# EAGLE design ottoesp-wrover (EAGLE 9.6.2)
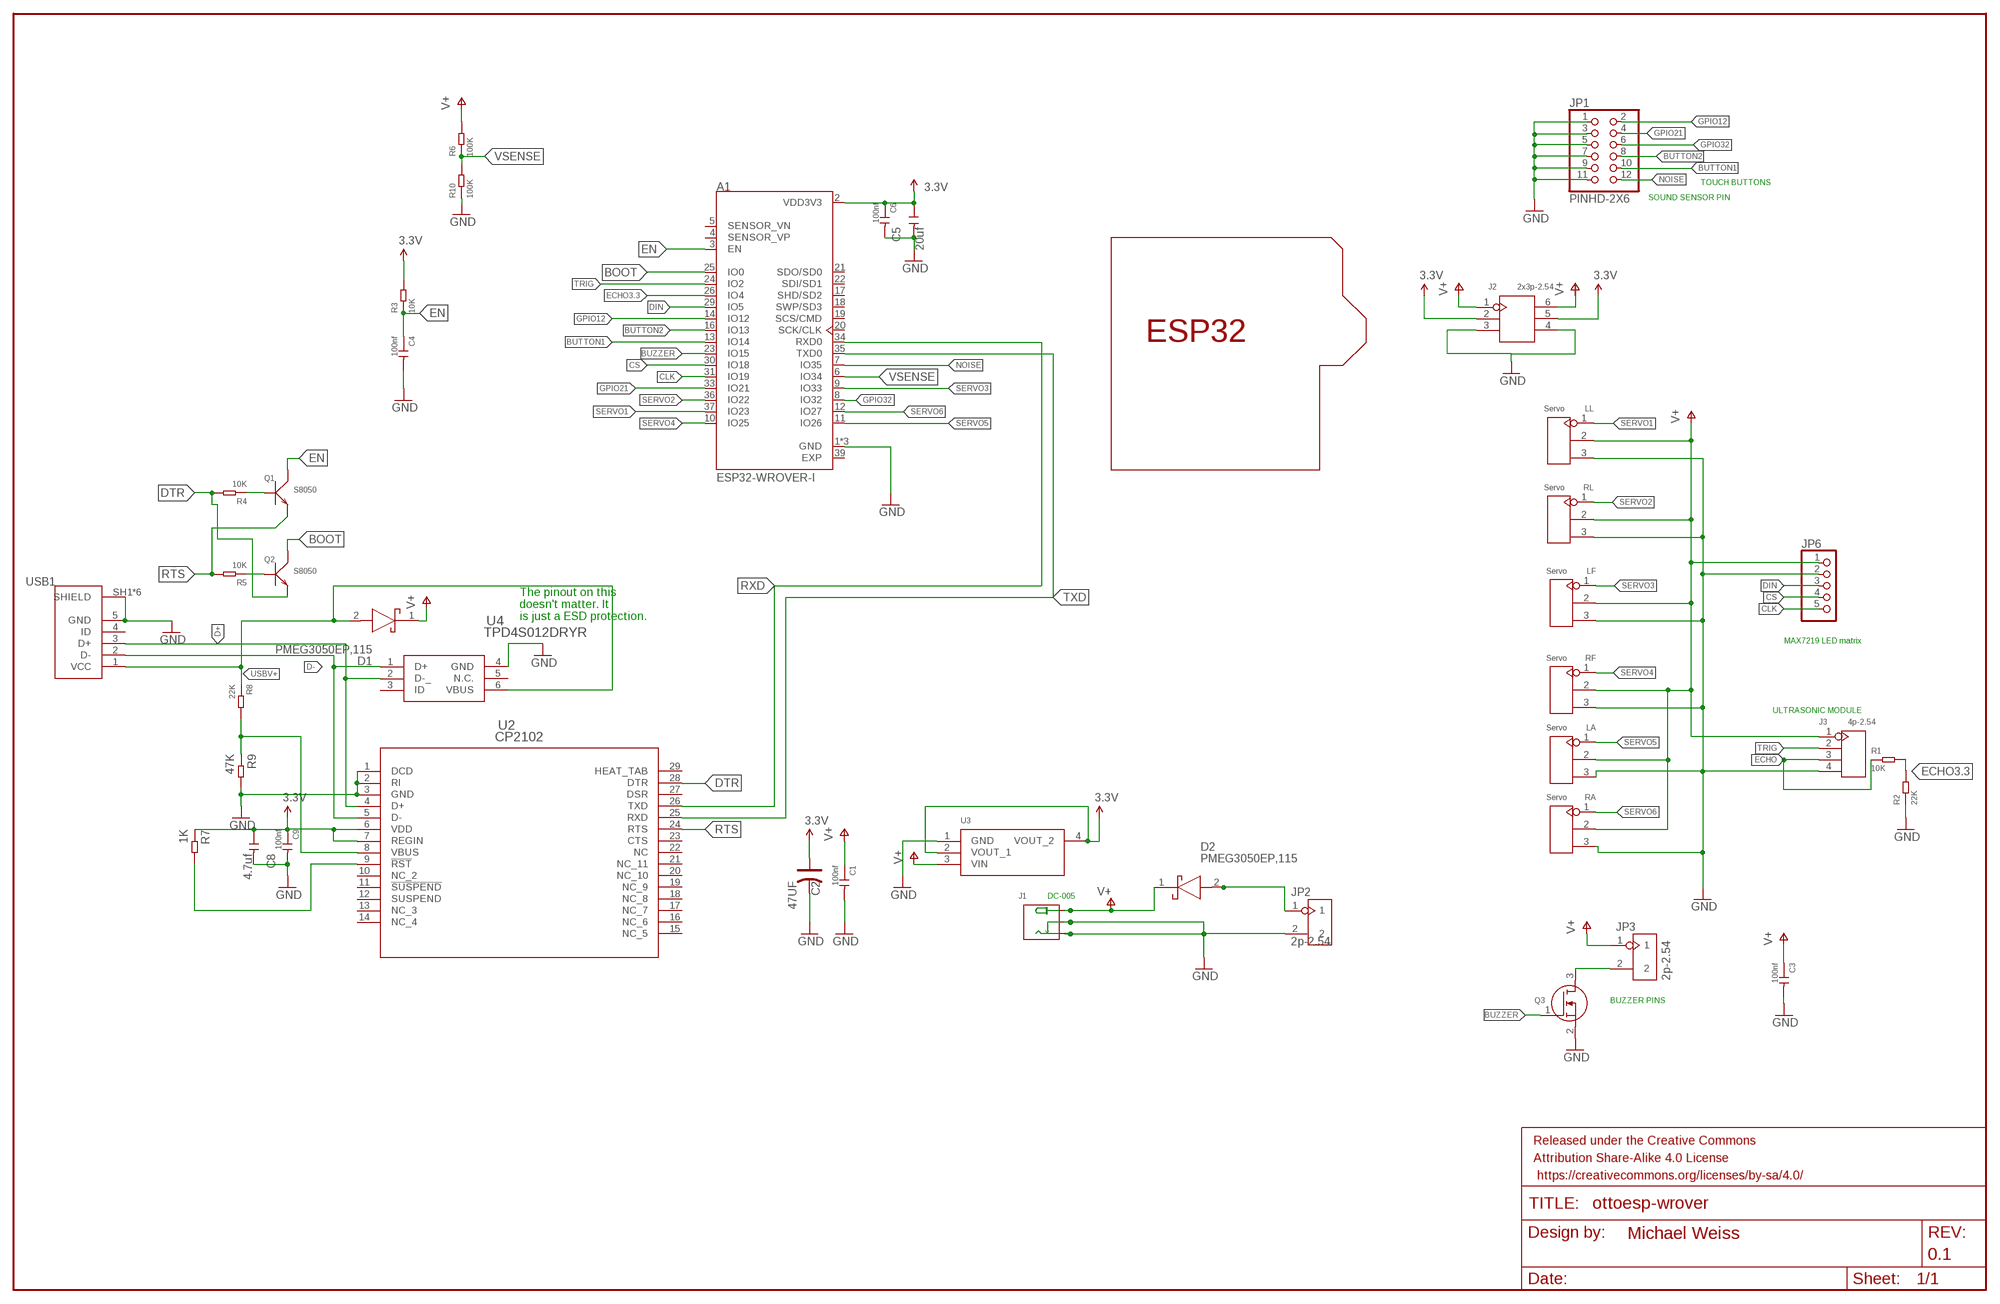
[diagram p0: schematic, sheet 1]

## Parts
A1  ESP32-WROVER-I  [XCVR_ESP32-WROVER-I]
C1  100nf  CERAMIC-100NF-50V-10%-X7R(0805)  [C0805]
C2  47UF  ALUMINUM-SMD-47UF-25V(D6.3-H5.3MM)  [ELECTRO-SMD-C-6MM]
C3  100nf  CERAMIC-100NF-50V-10%-X7R(0805)  [C0805]
C4  100nf  CERAMIC-100NF-50V-10%-X7R(0805)  [C0805]
C5  20uf  CERAMIC-22UF-16V-10%-X7R(1206)  [C1206]
C6  100nf  CERAMIC-100NF-50V-10%-X7R(0805)  [C0805]
C8  4.7uf  CERAMIC-4.7UF-25V-10%-X5R(0805)  [C0805]
C9  100nf  CERAMIC-100NF-50V-10%-X7R(0805)  [C0805]
D1  PMEG3050EP,115  [PMEG3050EP115]
D2  PMEG3050EP,115  [PMEG3050EP115]
FRAME1  FRAME-LEDGERMISHAFARMS  [MISHAFARMS]
J1  DC-005  CONN-POWER-JACK-2.1MM(DC-005)  [DCJ3P-14.2X11.0X9.0MM]
J2  2x3p-2.54  DIP-BLACK-MALE-HEADER(2X3P-2.54）-2.54  [H2X3-2.54]
J3  4p-2.54  DIP-BLACK-MALE-HEADER-VERT(4P-2.54)  [H4-2.54]
JP1  PINHD-2X6  [2X06]
JP2  2p-2.54  DIP-BLACK-MALE-HEADER-VERT(2P-2.54)  [H2-2.54]
JP3  2p-2.54  DIP-BLACK-MALE-HEADER-VERT(2P-2.54)  [H2-2.54]
JP6  PINHD-1X5  [1X05]
LA  Servo  DIP-BLACK-MALE-HEADER-VERT(3P-2.54)  [H3-2.54]
LF  Servo  DIP-BLACK-MALE-HEADER-VERT(3P-2.54)  [H3-2.54]
LL  Servo  DIP-BLACK-MALE-HEADER-VERT(3P-2.54)  [H3-2.54]
Q1  S8050  SMD-TRANSISTORS-NPN-25V-500MW-S8050(SOT-23)  [SOT-23]
Q2  S8050  SMD-TRANSISTORS-NPN-25V-500MW-S8050(SOT-23)  [SOT-23]
Q3  CJ2302  2N7002NXAKR  [SOT95P230X110-3N]
R1  10K  SMD-RES-10K-1%-1/8W(0805)  [R0805]
R2  22K  SMD-RES-20K-5%-1/8W(0805)  [R0805]
R3  10K  SMD-RES-10K-1%-1/8W(0805)  [R0805]
R4  10K  SMD-RES-10K-1%-1/8W(0805)  [R0805]
R5  10K  SMD-RES-10K-1%-1/8W(0805)  [R0805]
R6  100K  SMD-RES-100K-1%-1/8W(0805)  [R0805]
R7  1K  SMD-RES-2K-1%-1/8W(0805)  [R0805]
R8  22K  SMD-RES-22K-1%-1/8W(0805)  [R0805]
R9  47K  SMD-RES-47R-1%-1/8W(0805)  [R0805]
R10  100K  SMD-RES-100K-1%-1/8W(0805)  [R0805]
RA  Servo  DIP-BLACK-MALE-HEADER-VERT(3P-2.54)  [H3-2.54]
RF  Servo  DIP-BLACK-MALE-HEADER-VERT(3P-2.54)  [H3-2.54]
RL  Servo  DIP-BLACK-MALE-HEADER-VERT(3P-2.54)  [H3-2.54]
U2  CP2102  [QFN28N5X5-0P5P]
U3  CJA1117B-3.3-SOT89  AP2114H-3.3TRG1  [SOT230P700X180-4N]
U4  TPD4S012DRYR  [TPD4S012DRYR]
U$2  ESP32_SHIELDSMALL  [ESP32_ARDUINOSHIELDSMALL]
USB1  ZX62-B-5PA  ZX62-B-5PA(33)  [HRS_ZX62-B-5PA(33)]

## Nets
3.3V [3.3V]: A1.2(VDD3V3) C2.+ C5.1 C6.1 C8.1 C9.1 J2.2 J2.5 R3.2 R7.1 U2.6(VDD) U2.7(REGIN) U3.2(VOUT_1) U3.4(VOUT_2)
BOOT: A1.25(IO0) Q2.3(C)
BUTTON1: A1.13(IO14) JP1.10
BUTTON2: A1.16(IO13) JP1.8
BUZZER: A1.23(IO15) Q3.1(G)
CLK: A1.31(IO19) JP6.5
CS: A1.30(IO18) JP6.4
D+: U2.4(D+) U4.2(D-_) USB1.3(D+)
D-: U2.5(D-) U4.1(D+) USB1.2(D-)
DIN: A1.29(IO5) JP6.3
DTR: Q2.2(E) R4.2 U2.28(DTR)
ECHO: J3.3 R1.1
ECHO3.3: A1.26(IO4) R1.2 R2.2
EN: A1.3(EN) C4.1 Q1.3(C) R3.1
GND: A1.1(GND) A1.15(GND) A1.38(GND) C1.2 C2.- C3.2 C4.2 C5.2 C6.2 C8.2 C9.2 J1.-1(-) J1.-2(CDN) J2.3 J2.4 J3.4 JP1.1 JP1.3 JP1.5 JP1.7 JP1.9 JP1.11 JP2.2 JP6.2 LA.3 LF.3 LL.3 Q3.2(S) R2.1 R9.2 R10.1 RA.3 RF.3 RL.3 U2.1(DCD) U2.2(RI) U2.3(GND) U3.1(GND) U4.4(GND) USB1.5(GND) USB1.SH1(SHIELD) USB1.SH2(SHIELD) USB1.SH3(SHIELD) USB1.SH4(SHIELD) USB1.SH5(SHIELD) USB1.SH6(SHIELD)
GPIO12: A1.14(IO12) JP1.2
GPIO21: A1.33(IO21) JP1.4
GPIO32: A1.8(IO32) JP1.6
N$3: JP3.2 Q3.3(D)
N$4: Q1.1(B) R4.1
N$5: Q2.1(B) R5.1
N$6: R7.2 U2.9(!RST)
N$7: R8.2 R9.1 U2.8(VBUS)
N$11 [V+]: D2.2(A) JP2.1
NOISE: A1.7(IO35) JP1.12
RTS: Q1.2(E) R5.2 U2.24(RTS)
RXD: A1.34(RXD0) U2.26(TXD)
SERVO1: A1.37(IO23) LL.1
SERVO2: A1.36(IO22) RL.1
SERVO3: A1.9(IO33) LF.1
SERVO4: A1.10(IO25) RF.1
SERVO5: A1.11(IO26) LA.1
SERVO6: A1.12(IO27) RA.1
TRIG: A1.24(IO2) J3.2
TXD: A1.35(TXD0) U2.25(RXD)
USBV+: D1.2(A) R8.1 U4.6(VBUS) USB1.1(VCC)
V+ [V+]: C1.1 C3.1 D1.1(K) D2.1(K) J1.+ J2.1 J2.6 J3.1 JP3.1 JP6.1 LA.2 LF.2 LL.2 R6.2 RA.2 RF.2 RL.2 U3.3(VIN)
VSENSE: A1.6(IO34) R6.1 R10.2
Unconnected: A1.4(SENSOR_VP) A1.5(SENSOR_VN) A1.17(SHD/SD2) A1.18(SWP/SD3) A1.19(SCS/CMD) A1.20(SCK/CLK) A1.21(SDO/SD0) A1.22(SDI/SD1) U2.10(NC_2) U2.11(!SUSPEND) U2.12(SUSPEND) U2.13(NC_3) U2.14(NC_4) U2.15(NC_5) U2.16(NC_6) U2.17(NC_7) U2.18(NC_8) U2.19(NC_9) U2.20(NC_10) U2.21(NC_11) U2.22(NC) U2.23(CTS) U2.27(DSR) U2.29(HEAT_TAB) U4.3(ID) U4.5(N.C.) USB1.4(ID)

## Notes on the sheet
- TOUCH BUTTONS
- SOUND SENSOR PIN
- The pinout on this
  doesn't matter. It
  is just a ESD protection.
- MAX7219 LED matrix
- ULTRASONIC MODULE
- BUZZER PINS

## Power pins joined to a net without a drawn wire
EXP: A1.39(EXP)

## Library data of the parts
A1 = ESP32-WROVER-I:ESP32-WROVER-I: Module: combo; GPIO, I2C x2, I2S x2, SDIO, SPI x3, UART x3; U.FL; AVAILABILITY: Unavailable; DESCRIPTION: Module: combo; GPIO, I2C x2, I2S x2, SDIO, SPI x3, UART x3; U.FL; MF: Espressif Systems; MP: ESP32-WROVER-I; PACKAGE: Module Espressif Systems; PRICE: None
C1 C4 C6 C9 = OPL_Capacitor:CERAMIC-100NF-50V-10%-X7R(0805): 302010165; MPN: CC0805KRX7R9BB104
C2 = OPL_Capacitor:ALUMINUM-SMD-47UF-25V(D6.3-H5.3MM): 302030059; MPN: CS1E470M-CRE54
C3 = Seeed-Capacitor:CERAMIC-100NF-50V-10%-X7R(0805): 302010165; MPN: CC0805KRX7R9BB104
C5 = OPL_Capacitor:CERAMIC-22UF-16V-10%-X7R(1206): 302010182
C8 = OPL_Capacitor:CERAMIC-4.7UF-25V-10%-X5R(0805): 302010146; MPN: CC0805KKX5R8BB475
D1 D2 = SamacSys_Parts:PMEG3050EP,115: NXP PMEG3050EP,115 SMT Schottky Diode, 30V 5A, 2-Pin SOD-128 Source: Datasheet; DESCRIPTION: NXP PMEG3050EP,115 SMT Schottky Diode, 30V 5A, 2-Pin SOD-128; HEIGHT: 1mm; MANUFACTURER_NAME: Nexperia; MANUFACTURER_PART_NUMBER: PMEG3050EP,115; MOUSER_PART_NUMBER: 771-PMEG3050EP115; MOUSER_PRICE-STOCK: https://www.mouser.co.uk/ProductDetail/Nexperia/PMEG3050EP115?qs=GcY6OjH1zdmnjQ%2FhUT5aOA%3D%3D
FRAME1 = SparkFun-Aesthetics:FRAME-LEDGER: Schematic Frame - Ledger Standard 11x14 US Ledger frame; DESIGNER: Michael Weiss; REV: 0.1
J1 = OPL_Connector:CONN-POWER-JACK-2.1MM(DC-005): 320120003; MPN: DC-005
J2 = OPL_Connector:DIP-BLACK-MALE-HEADER(2X3P-2.54）: 320020077; MPN: P125-12A1BS116A1
J3 = OPL_Connector:DIP-BLACK-MALE-HEADER-VERT(4P-2.54): 320020017; MPN: P125-1104A0BS116A1
JP1 = Connector:PINHD-2X6: PIN HEADER; CATEGORY: CONNECTOR; SUB-CATEGORY: PIN-HEADER
JP2 JP3 = OPL_Connector:DIP-BLACK-MALE-HEADER-VERT(2P-2.54): 320020016; MPN: P125-1102A0BS116A1
JP6 = pinhead:PINHD-1X5: PIN HEADER
LA LF LL RA RF RL = OPL_Connector:DIP-BLACK-MALE-HEADER-VERT(3P-2.54): 320020079; VALUE: 3p-2.54
Q1 Q2 = OPL_Discrete_Semiconductor:SMD-TRANSISTORS-NPN-25V-500MW-S8050(SOT-23): 305010017; MPN: S8050
Q3 = SamacSys_Parts:2N7002NXAKR: NEXPERIA - 2N7002NXAKR - MOSFET Transistor, Trench, N Channel, 190 mA, 60 V, 3 ohm, 10 V, 1.6 V Source: Datasheet; DESCRIPTION: NEXPERIA - 2N7002NXAKR - MOSFET Transistor, Trench, N Channel, 190 mA, 60 V, 3 ohm, 10 V, 1.6 V; HEIGHT: 1.1mm; MANUFACTURER_NAME: Nexperia; MANUFACTURER_PART_NUMBER: 2N7002NXAKR; MOUSER_PART_NUMBER: 771-2N7002NXAKR; MOUSER_PRICE-STOCK: https://www.mouser.co.uk/ProductDetail/Nexperia/2N7002NXAKR?qs=%252B6g0mu59x7JoAsZYPFXqhw%3D%3D
R1 R3-R5 = OPL_Resistor:SMD-RES-10K-1%-1/8W(0805): 301012152; MPN: RC0805FR-0710KL
R2 = OPL_Resistor:SMD-RES-20K-5%-1/8W(0805): 301012190; MPN: RC0805JR-071KL; VALUE: 1K
R6 R10 = OPL_Resistor:SMD-RES-100K-1%-1/8W(0805): 301012150; MPN: RC0805JR-071KL; VALUE: 1K
R7 = OPL_Resistor:SMD-RES-2K-1%-1/8W(0805): 301012164; MPN: RC0805JR-071KL
R8 = OPL_Resistor:SMD-RES-22K-1%-1/8W(0805): 301012161; MPN: RC0805JR-071KL; VALUE: 1K
R9 = OPL_Resistor:SMD-RES-47R-1%-1/8W(0805): 301012174; MPN: RC0805JR-071KL; VALUE: 1K
U2 = cp2102:CP2102; MANUFACTURER_PART_NUMBER: CP2102; VENDOR: Silicon Labs
U3 = SamacSys_Parts:AP2114H-3.3TRG1: 1A 3.3V Low Noise LDO Regulator SOT223 DiodesZetex AP2114H-3.3TRG1, LDO Voltage Regulator, 1 (Min)A, 3.3 V +/-1.5%, 2.5 6 Vin, 3-Pin SOT-223 Source: Datasheet; DESCRIPTION: 1A 3.3V Low Noise LDO Regulator SOT223 DiodesZetex AP2114H-3.3TRG1, LDO Voltage Regulator, 1 (Min)A, 3.3 V +/-1.5%, 2.5 6 Vin, 3-Pin SOT-223; HEIGHT: 1.8mm; MANUFACTURER_NAME: Diodes Inc.; MANUFACTURER_PART_NUMBER: AP2114H-3.3TRG1; MOUSER_PART_NUMBER: 621-AP2114H-3.3TRG1; MOUSER_PRICE-STOCK: https://www.mouser.co.uk/ProductDetail/Diodes-Incorporated/AP2114H-33TRG1?qs=x6A8l6qLYDDSG%2FfwzcsOhw%3D%3D
U4 = SamacSys_Parts:TPD4S012DRYR: ESD Suppressors / TVS Diodes 4Ch USB ESD Solution w/ Pwr Clamp Source: Datasheet <https://www.ti.com/lit/gpn/TPD4S012>; DESCRIPTION: ESD Suppressors / TVS Diodes 4Ch USB ESD Solution w/ Pwr Clamp; HEIGHT: 0.6mm; MANUFACTURER_NAME: Texas Instruments; MANUFACTURER_PART_NUMBER: TPD4S012DRYR; MOUSER_PART_NUMBER: 595-TPD4S012DRYR; MOUSER_PRICE-STOCK: https://www.mouser.co.uk/ProductDetail/Texas-Instruments/TPD4S012DRYR?qs=XGzIaZb%2FFYJve%2FbrCpoVgg%3D%3D
U$2 = ottoesp:ESP32_SHIELDSMALL
USB1 = XLibrary:ZX62-B-5PA(33): ZX Series 5 Position Right Angle PCB Wire Micro B USB Plug; AVAILABILITY: Unavailable; DESCRIPTION: ZX Series 5 Position Right Angle PCB Wire Micro B USB Plug; MF: Hirose; MP: ZX62-B-5PA_33_; PACKAGE: None; PRICE: None

## Net classes
1 3.3V: width 0.406 mm
2 V+: width 1.016 mm

## Board
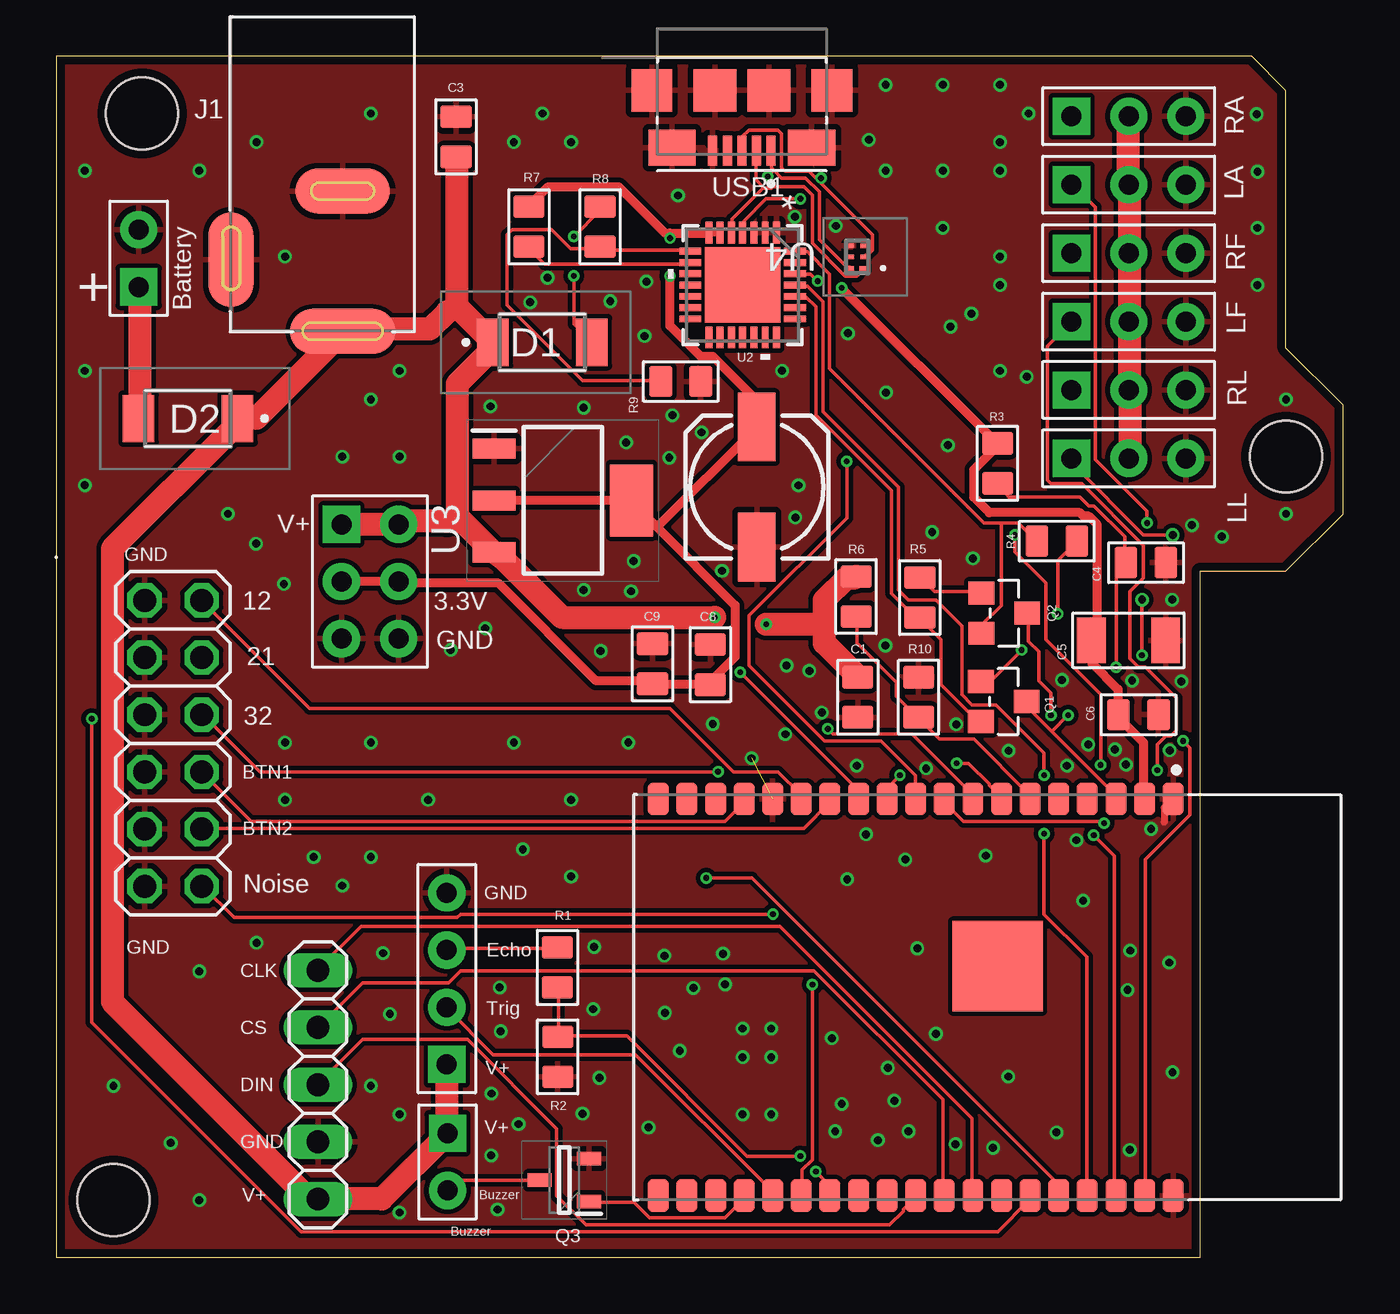
[diagram p1: board, top side]
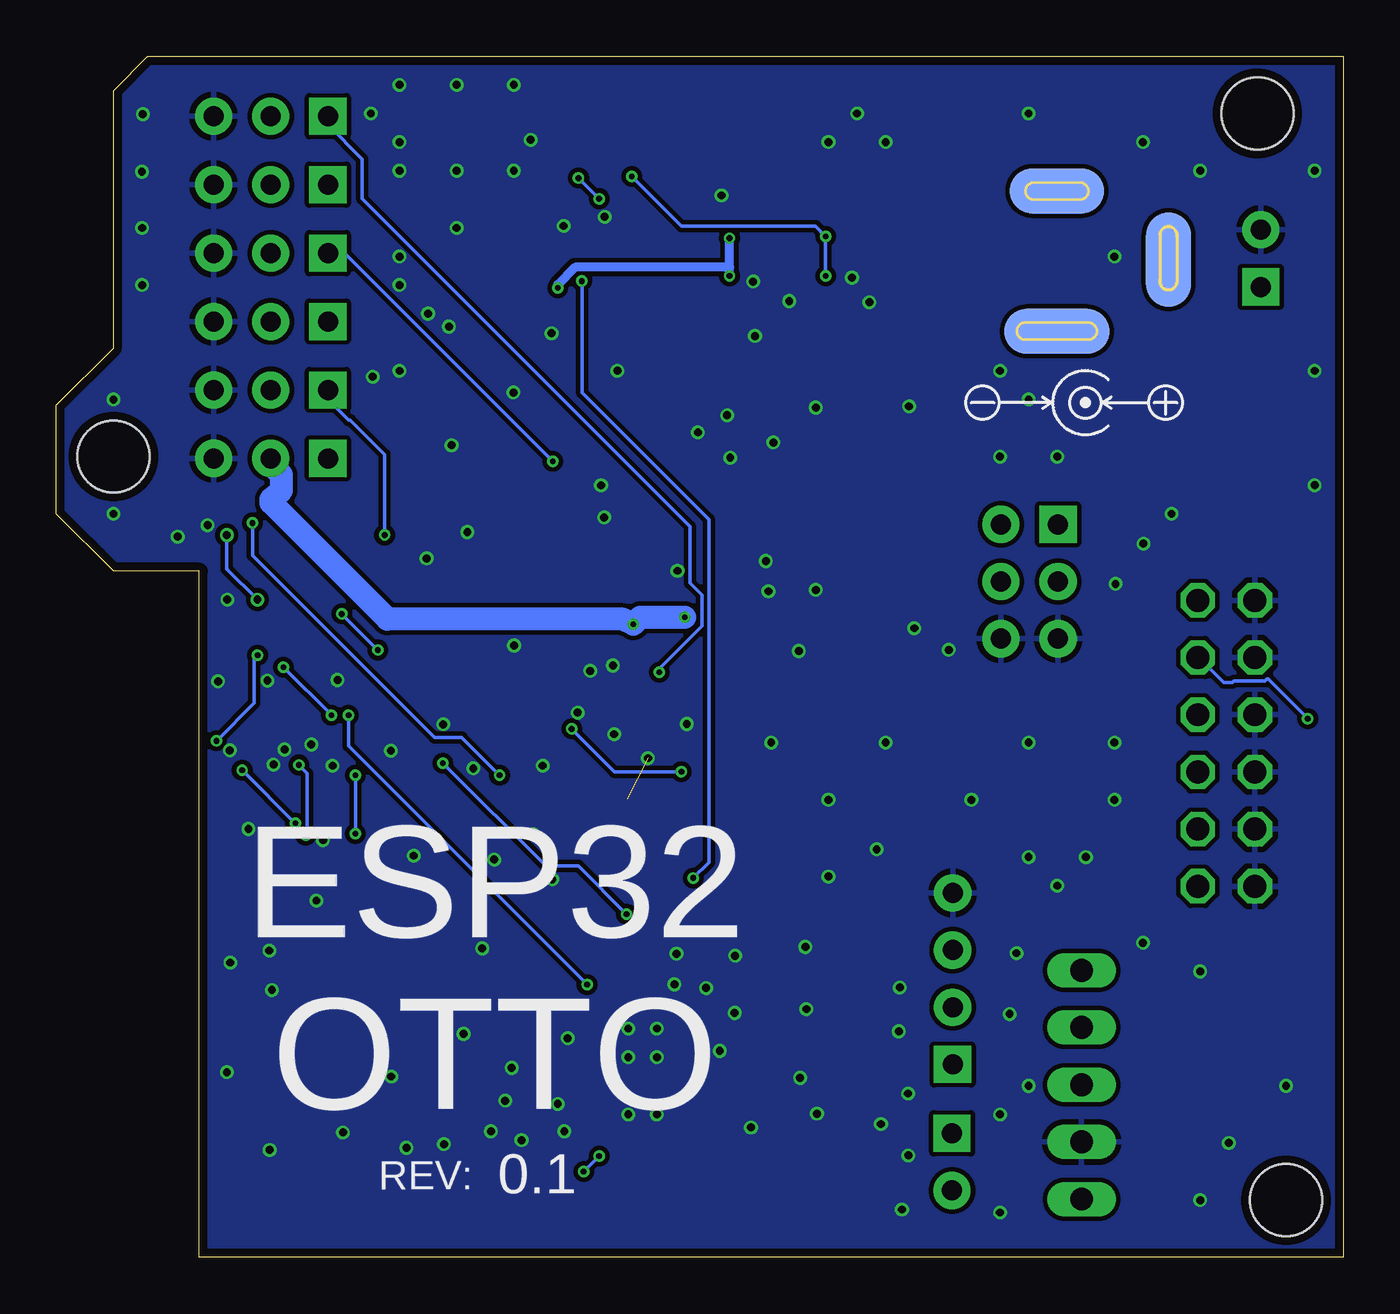
[diagram p2: board, bottom side, seen from below]

Size 57.15 x 53.34 mm. Coordinates in mm from the lower left corner, seen from the top.
Copper layers (1*16): Top 0.035559375mm / dielectric 1.6mm / Bottom 0.035559375mm
Design rules "oshpark-2layer": minimum track width 6mil, minimum drill 10mil, track to track 6mil, track to pad 6mil, pad to pad 6mil, via to via 6mil, smd to smd 6mil, copper to edge 15mil, drill to drill 6mil, minimum pad ring 5mil, minimum via ring 5mil, stop-mask expansion 2.5mil, vias tented up to drill 0mil, thermal gap 10mil

### Footprints (pad centres in the part's own frame; a part is rotated, then mirrored left to right if it is on the bottom)
XCVR_ESP32-WROVER-I = smd 1.45 x 0.93: 1 -8.81,8.26; 2 -8.81,6.99; 3 -8.81,5.72; 4 -8.81,4.45; 5 -8.81,3.18; 6 -8.81,1.91; 7 -8.81,0.64; 8 -8.81,-0.63; 9 -8.81,-1.9; 10 -8.81,-3.17; 11 -8.81,-4.44; 12 -8.81,-5.71; 13 -8.81,-6.98; 14 -8.81,-8.25; 15 -8.81,-9.52; 16 -8.81,-10.79; 17 -8.81,-12.06; 18 -8.81,-13.33; 19 -8.81,-14.6; 20 8.81,-14.6; 21 8.81,-13.33; 22 8.81,-12.06; 23 8.81,-10.79; 24 8.81,-9.52; 25 8.81,-8.25; 26 8.81,-6.98; 27 8.81,-5.71; 28 8.81,-4.44; 29 8.81,-3.17; 30 8.81,-1.9; 31 8.81,-0.63; 32 8.81,0.64; 33 8.81,1.91; 34 8.81,3.18; 35 8.81,4.45; 36 8.81,5.72; 37 8.81,6.99; 38 8.81,8.26 | smd 4 x 4: 39 -1.38,0.47
C0805 = smd 1.397 x 1.016: 1 0,0.889; 2 0,-0.889
ELECTRO-SMD-C-6MM = smd 3.048 x 1.651: + 2.667,0; - -2.667,0
C1206 = smd 1.27 x 2.032: 1 -1.651,0; 2 1.651,0
PMEG3050EP115 = smd 1.4 x 2.1: 1 -2.2,0; 2 2.2,0
DCJ3P-14.2X11.0X9.0MM = smd 2 x 4.7: + 3.175,0 | smd 2 x 4.7 bottom: +1 3.175,0 | smd 2 x 4.2: -1 -3.048,0 | smd 4.2 x 2: -2 0,-4.953 | smd 2 x 4.2 bottom: -3 -3.048,0 | smd 4.2 x 2 bottom: -4 0,-4.953
H2X3-2.54 = drill 0.889 pad 1.651 square: 1 -1.27,2.54 | drill 0.889 pad 1.651: 2 -1.27,0; 3 -1.27,-2.54; 4 1.27,-2.54; 5 1.27,0; 6 1.27,2.54
H4-2.54 = drill 0.889 pad 1.651 square: 1 0,3.81 | drill 0.889 pad 1.651: 2 0,1.27; 3 0,-1.27; 4 0,-3.81
2X06 = drill 1.016 octagon: 1 -6.35,-1.27; 2 -6.35,1.27; 3 -3.81,-1.27; 4 -3.81,1.27; 5 -1.27,-1.27; 6 -1.27,1.27; 7 1.27,-1.27; 8 1.27,1.27; 9 3.81,-1.27; 10 3.81,1.27; 11 6.35,-1.27; 12 6.35,1.27
H2-2.54 = drill 0.889 pad 1.651 square: 1 0,1.27 | drill 0.889 pad 1.651: 2 0,-1.27
1X05 = drill 1.016 long: 1 -5.08,0; 2 -2.54,0; 3 0,0; 4 2.54,0; 5 5.08,0
H3-2.54 = drill 0.889 pad 1.651 square: 1 0,2.54 | drill 0.889 pad 1.651: 2 0,0; 3 0,-2.54
SOT-23 = smd 1.016 x 1.143: 1 -0.889,-1.016; 2 0.889,-1.016; 3 0,1.016
SOT95P230X110-3N = smd 1.05 x 0.6: 1 -1.1,0.95; 2 -1.1,-0.95; 3 1.1,0
R0805 = smd 1.397 x 1.016: 1 0,0.889; 2 0,-0.889
QFN28N5X5-0P5P = smd 0.965 x 0.305: 1 -2.324,1.5; 2 -2.324,1; 3 -2.324,0.5; 4 -2.324,0; 5 -2.324,-0.5; 6 -2.324,-1; 7 -2.324,-1.5; 15 2.324,-1.5; 16 2.324,-1; 17 2.324,-0.5; 18 2.324,0; 19 2.324,0.5; 20 2.324,1; 21 2.324,1.5 | smd 0.305 x 0.965: 8 -1.5,-2.324; 9 -1,-2.324; 10 -0.5,-2.324; 11 0,-2.324; 12 0.5,-2.324; 13 1,-2.324; 14 1.5,-2.324; 22 1.5,2.324; 23 1,2.324; 24 0.5,2.324; 25 0,2.324; 26 -0.5,2.324; 27 -1,2.324; 28 -1.5,2.324 | smd 3.353 x 3.353: 29 0,0
SOT230P700X180-4N = smd 1.9 x 0.9: 1 -3.05,2.3; 2 -3.05,0; 3 -3.05,-2.3 | smd 1.9 x 3.2: 4 3.05,0
TPD4S012DRYR = smd 0.35 x 0.2: 1 -0.275,0.5 | smd 0.3 x 0.2: 2 -0.3,0; 3 -0.3,-0.5; 4 0.3,-0.5; 5 0.3,0; 6 0.3,0.5
ESP32_ARDUINOSHIELDSMALL = hole 3.2: -13.97,33.02; 36.83,17.78; -15.24,-15.24
HRS_ZX62-B-5PA(33) = smd 0.4 x 1.35: 1 -1.3,2.675; 2 -0.65,2.675; 3 0,2.675; 4 0.65,2.675; 5 1.3,2.675 | smd 2.1 x 1.6: SH1 -3.1,2.55; SH6 3.1,2.55 | smd 1.8 x 1.9: SH2 -4,0; SH5 4,0 | smd 1.9 x 1.9: SH3 -1.2,0; SH4 1.2,0

### Placement (x,y rotation side)
A1  41.34,11.55 270 top
C1  35.59,24.88 0 top
C2  31.11,34.21 90 top
C3  17.75,49.76 180 top
C4  48.39,30.86 90 top
C5  47.62,27.4 0 top
C6  48.06,24.1 90 top
C8  29.04,26.32 180 top
C9  26.48,26.36 180 top
D1  21.59,40.64 0 top
D2  5.85,37.25 180 top
FRAME1  38.66,4.29 180 top
J1  12.72,44.31 270 top
J2  13.93,30.01 0 top
J3  17.34,12.38 180 top
JP1  5.19,22.83 270 top
JP2  3.66,44.37 180 top
JP3  17.37,4.24 0 top
JP6  11.62,7.67 90 top
LA  47.63,47.64 90 top
LF  47.63,41.56 90 top
LL  47.63,35.48 90 top
Q1  42.08,24.69 270 top
Q2  42.1,28.61 270 top
Q3  22.56,3.43 180 top
R1  22.25,12.87 0 top
R2  22.27,8.9 180 top
R3  41.8,35.26 180 top
R4  44.43,31.81 270 top
R5  38.35,29.31 0 top
R6  35.52,29.35 180 top
R7  20.99,45.77 0 top
R8  24.15,45.77 0 top
R9  27.73,38.9 90 top
R10  38.29,24.88 0 top
RA  47.63,50.68 90 top
RF  47.63,44.6 90 top
RL  47.63,38.52 90 top
U2  30.48,43.18 270 top
U3  22.49,33.61 0 top
U4  35.57,44.43 180 top
U$2  17.78,17.78 0 top
USB1  30.45,51.82 180 top

### Tracks (layer width: path | path; a pad name or v marks a point on that pad's centre or on a via)
3.3V  (via drill 0.25)
  Top 0.305: 29.01,45.49 29.46,45.49 U2.6
  Top 0.406: A1.2 48.28,20.42 48.28,22.86 47.22,23.93 C6.1 47.14,24.16 47.14,25.22 46,26.36 46,27.2 C5.1 46,27.43 46.23,27.66 46.23,32.54 45.85,32.92 45.62,32.92 45.47,33.07 41.43,33.07 40.74,33.76 40.74,34.98 41.73,35.97 41.73,36.12 R3.2 41.66,36.27 v34.87,43.05 | 29.01,45.49 U2.7 28.78,45.49 27.25,45.49 | 27.25,45.49 27.03,45.49 24.97,47.55 21.84,47.55 21.01,46.71 R7.1 | U3.2 19.48,33.6 25.5,33.6 U3.4 25.65,33.45 26.68,32.42 | 26.68,32.42 30.15,28.96 30.15,26.67 29.08,25.6 C8.1 29.01,25.45 26.49,25.45 C9.1 26.34,25.6 23.98,25.6 19.63,29.95 15.37,29.95 J2.5 15.14,30.02 12.7,30.02 J2.2 | 26.68,32.42 31.06,36.8 C2.+ 30.99,37.03 30.99,38.18 29.16,40.01 28.63,40.01 27.25,41.38 v27.25,43.59 | v27.25,45.26 27.25,45.49
  Bottom 0.406: v27.25,43.59 27.25,43.97 | 27.25,43.97 v27.25,45.26 | v34.87,43.05 34.87,43.2 34.11,43.97 27.25,43.97
BOOT  (via drill 0.25)
  Top 0.152: v44.17,24.08 44.17,25.07 43.64,25.6 43.64,26.9 43.18,27.36 43.18,28.57 Q2.3 | v33.58,12.12 33.58,4.34 33.12,3.89 33.12,2.74 A1.25
  Bottom 0.152: v44.17,24.08 44.17,22.71 v33.58,12.12
BUTTON1
  Top 0.152: A1.13 34.34,20.34 34.34,20.19 33.2,19.05 6.53,19.05 JP1.10
BUTTON2
  Top 0.152: A1.16 30.53,20.34 30.53,20.19 29.69,19.36 8.66,19.36 6.53,21.49 JP1.8
BUZZER
  Top 0.152: Q3.1 23.67,2.44 25.65,2.44 26.34,1.75 29.69,1.75 30.61,2.67 A1.23
CLK
  Top 0.152: A1.31 40.67,2.74 40.67,6.17 32.13,14.71 13.54,14.71 11.63,12.8 JP6.5
CS
  Top 0.152: A1.30 39.37,2.74 39.37,7.01 33.66,12.72 17.96,12.72 17.42,12.19 13.61,12.19 11.63,10.21 JP6.4
D+  (via drill 0.25)
  Top 0.152: 33.84,47.82 33.43,48.23 32.36,48.23 32.21,48.39 32.21,49.91 32.06,50.06 30.76,50.06 30.46,49.76 USB1.3 | 33.84,47.82 36.25,45.41 36.25,44.73 36.02,44.5 35.94,44.5 U4.2 | v33.05,47.02 31.52,47.02 30.53,46.02 30.53,45.57 U2.4 | 33.84,47.82 v33.96,47.93
  Bottom 0.152: v33.96,47.93 v33.05,47.02
D-
  Top 0.152: 31.41,47.51 31.06,47.85 31.06,49.07 USB1.2 | 31.41,47.51 31.44,47.47 31.75,47.47 31.83,47.55 33.2,47.55 33.58,47.17 33.58,45.03 35.03,43.59 35.56,43.59 35.79,43.81 35.79,43.89 U4.1 | 31.41,47.51 30,46.1 30,45.57 U2.5
DIN
  Top 0.152: A1.29 38.15,2.67 37.62,2.13 37.62,2.06 37.01,1.45 23.52,1.45 22.22,2.74 22.22,5.71 18.26,9.68 13.61,9.68 11.63,7.7 JP6.3
DTR
  Top 0.152: 41.96,32.61 42.72,32.61 43.48,31.85 R4.2 | 41.96,32.61 41.2,32.61 34.34,39.47 34.34,43.66 33.35,44.65 32.82,44.65 U2.28 | 41.96,32.61 41.96,28.96 41.12,28.12 41.12,27.74 Q2.2
ECHO
  Top 0.152: R1.1 22.22,13.72 17.35,13.72 J3.3
ECHO3.3  (via drill 0.25)
  Top 0.152: R1.2 22.3,11.96 22.3,9.83 R2.2 22.38,9.83 25.35,9.83 30.68,4.5 v33.05,4.5 | v33.73,3.81 34.34,3.2 34.34,2.74 A1.26
  Bottom 0.152: v33.05,4.5 v33.73,3.81
EN  (via drill 0.25)
  Top 0.152: 44.21,23.36 46.99,20.57 46.99,20.42 A1.3 | 44.21,23.36 43.1,24.46 43.1,24.61 Q1.3 | R3.1 42.31,33.77 45.45,33.77 45.85,33.38 46.08,33.38 47.45,32 47.45,30.86 C4.1 47.45,30.79 47.07,30.4 v47.07,26.21 | v44.93,24.08 44.21,23.36
  Bottom 0.152: v47.07,26.21 v44.93,24.08
GND  (via drill 0.35)  (1 unrouted)
  Top 0.305: 49.2,19.96 49.2,19.32
  other vias: 32.8,46.21 34.62,45.81 26.21,43.34 19.28,37.79 26.12,40.92 23.42,37.74 27.36,37.4 28.66,36.64 27.22,35.51 25.31,36.19 24.6,42.47 24.12,7.97 23.37,6.38 26.3,5.77 27.69,9.17 27.03,10.86 28.29,11.96 29.7,12.13 29.61,13.49 27.01,13.39 14.51,13.51 14.81,10.81 19.69,11.98 19.74,10.04 23.89,13.79 23.84,11.02 20.53,5.92 19.31,4.53 19.32,7.27 29.15,23.69 30.88,22.17 33.99,24.19 32.37,23.23 32.43,26.29 33.44,26.05 39.96,23.67 36.82,27.17 42.29,22.5 35.96,18.79 35.55,21.83 38.63,21.72 44.88,21.83 45.3,18.53 45.83,22.78 49.44,22.52 47.77,25.61 50.43,32.51 51.76,32.01 49.55,29.21 49.96,25.58 23.42,29.64 25.52,29.58 25.64,30.93 36.85,38.41 35.16,41.04 39.71,41.33 43.1,39.11 39.6,36.07 38.9,32.21 40.71,31.04 34.88,6.81 34.44,9.73 37.22,6.96 36.92,8.42 36.49,5.21 37.85,5.6 34.59,5.6 44.41,5.55 42.27,8.03 39.06,9.93 38.24,13.72 35.12,16.79 37.7,17.66 41.27,17.84 45.6,15.84 47.67,4.77 47.58,11.87 49.57,8.22 49.42,13.09 47.69,13.62 32.96,34.29 32.82,32.86 29.56,30.49 10.11,29.91 17.51,26.98 19.05,27.94 8.87,31.69 15.24,35.56 13.97,38.1 12.7,35.56 7.62,33.02 1.27,34.29 1.27,39.37 1.27,48.26 6.35,48.26 8.89,49.53 10.16,44.45 20.32,49.53 21.59,50.8 22.86,49.53 39.37,48.26 36.83,48.26 36.83,52.07 39.37,52.07 41.91,52.07 41.91,49.53 41.91,48.26 39.37,45.72 41.91,44.45 41.91,43.18 40.64,41.91 41.91,39.37 43.18,50.8 53.34,45.72 53.34,43.18 54.61,38.1 54.61,33.02 13.97,22.86 20.32,22.86 25.4,22.86 10.16,22.86 10.16,20.32 16.51,20.32 22.86,20.32 12.7,16.51 8.89,13.97 6.35,12.7 2.54,7.62 5.08,5.08 6.35,2.54 13.97,50.8 15.24,39.37 15.24,1.99 19.59,2.12 20.72,18.12 22.86,16.91 13.97,17.78 11.43,17.78 13.97,7.62 15.24,6.35 30.48,6.35 31.75,6.35 30.48,8.89 31.75,8.89 31.75,10.16 30.48,10.16 41.6,4.86 39.94,5.03 21.82,43.51 21.05,42.42 32.23,39.37 27.61,47.16 36.08,49.63 53.31,50.77 53.35,48.21 47.02,22.55 47.51,21.89 24.17,26.93 44.66,25.64 48.62,19.03
  pour Bottom (isolate 0.203): 0,53.34 53.34,53.34 54.61,52.07 54.61,40.64 57.15,38.1 57.15,33.02 54.61,30.48 50.8,30.48 50.8,0 0,0
  pour Top (isolate 0.203, rank 2): 0,53.34 53.34,53.34 54.61,52.07 54.61,40.64 57.15,38.1 57.15,33.02 54.61,30.48 50.8,30.48 50.8,0 0,0
GPIO12
  Top 0.152: A1.14 33.05,20.42 33.05,20.57 32.06,21.57 30.07,21.57 27.25,24.38 11.25,24.38 6.53,29.11 JP1.2
GPIO21  (via drill 0.25)
  Top 0.152: v1.57,23.93 1.57,10.44 10.87,1.14 41.81,1.14 43.18,2.52 43.18,2.67 A1.33
  Bottom 0.152: v1.57,23.93 3.33,25.68 3.4,25.68 3.48,25.6 4.85,25.6 4.93,25.53 5.31,25.53 6.45,26.67 JP1.4
GPIO32  (via drill 0.25)
  Top 0.152: v34.27,23.47 34.49,23.24 38,23.24 40.67,20.57 40.67,20.42 A1.8 | v29.39,21.57 9.04,21.57 6.53,24.08 JP1.6
  Bottom 0.152: v34.27,23.47 32.36,21.57 v29.39,21.57
N$3
  Top 0.152: Q3.3 21.39,3.43 17.88,3.43 17.42,2.97 JP3.2
N$4  (via drill 0.25)
  Top 0.152: v42.88,26.98 41.5,25.6 41.12,25.6 Q1.1 | v44.47,28.57 44.47,30.94 45.31,31.77 R4.1
  Bottom 0.152: v44.47,28.57 v42.88,26.98
N$5
  Top 0.152: Q2.1 41.05,29.57 38.99,29.57 38.38,30.18 R5.1
N$6
  Top 0.152: U2.9 28.09,44.12 21.69,44.12 21.01,44.81 R7.2
N$7
  Top 0.152: U2.8 28.09,44.73 24.28,44.73 24.21,44.81 R8.2 24.13,44.81 22.83,44.81 22,45.64 20.24,45.64 20.02,45.41 20.02,42.29 23.37,38.94 26.8,38.94 R9.1
N$11
  Top 1.016: D2.2 3.71,37.26 3.71,43.05 JP2.1
NOISE  (via drill 0.25)
  Top 0.152: v39.98,21.95 40.51,21.95 41.43,21.03 41.43,20.95 41.96,20.42 A1.7 | v31.83,15.24 17.96,15.24 17.8,15.09 7.9,15.09 6.53,16.46 JP1.12
  Bottom 0.152: v39.98,21.95 35.41,17.37 33.96,17.37 v31.83,15.24
RTS
  Top 0.152: U2.24 32.82,42.67 33.27,42.67 33.73,42.22 33.73,37.41 37.08,34.06 37.08,29.49 38.15,28.42 38.3,28.42 R5.2 38.38,28.35 39.29,27.43 39.29,25.45 40.89,23.85 41.05,23.85 Q1.2
RXD  (via drill 0.25)
  Top 0.152: v33.81,43.36 33.5,43.66 32.82,43.66 U2.26 | v28.87,16.85 30.9,16.85 44.47,3.28 44.47,2.74 A1.34
  Bottom 0.152: v33.81,43.36 33.81,38.41 28.17,32.77 28.17,17.55 v28.87,16.85
SERVO1  (via drill 0.25, 0.35)
  Top 0.152: v50.04,22.94 50.34,22.63 50.34,19.66 48.36,17.68 48.36,2.74 A1.37 | v48.21,26.75 48.21,28.65 48.22,28.66 v48.22,29.21 | v49.58,32.08 48.28,32.08 45.16,35.2 45.16,35.43 LL.1
  Bottom 0.152: v50.04,22.94 48.36,24.61 48.36,26.59 v48.21,26.75 | v48.22,29.21 49.59,30.58 v49.59,32.09 | v49.59,32.09 | v49.59,32.09 v49.58,32.08
SERVO2  (via drill 0.25)
  Top 0.152: v46.08,18.75 46.99,17.83 46.99,2.74 A1.36 | v46.38,21.87 46.38,24.99 43.94,27.43 43.94,29.95 42.57,31.32 v42.57,32.08
  Bottom 0.152: v46.08,18.75 46.08,19.05 46,19.13 46,21.49 v46.38,21.87 | v42.57,32.08 42.57,35.66 44.09,37.19 44.17,37.19 45.08,38.1 45.08,38.48 RL.1
SERVO3  (via drill 0.25)
  Top 0.152: v46.53,19.28 46.46,19.36 40.28,19.36 39.45,20.19 39.45,20.34 A1.9 | v48.89,21.64 48.89,22.78 49.28,23.16 49.5,23.16 49.73,23.39 49.73,24.84 48.36,26.21 48.06,26.21 47.68,26.59 47.68,29.57 48.28,30.18 48.28,31.62 45.54,34.37 44.17,34.37 44.02,34.52 44.02,40.46 45.08,41.53 LF.1
  Bottom 0.152: v48.89,21.64 v46.53,19.28
SERVO4  (via drill 0.25)
  Top 0.152: v35.1,35.36 35.1,32.84 30.76,28.5 30.76,26.29 34.11,22.94 36.63,22.94 38.15,21.41 38.15,20.42 A1.10
  Bottom 0.152: v35.1,35.36 44.32,44.58 45.08,44.58 RF.1
SERVO5  (via drill 0.25)
  Top 0.152: v37.47,21.41 36.93,20.88 36.93,20.42 A1.11 | v48.44,32.61 48.44,33.15 46.15,35.43 46.15,46.63 45.16,47.62 LA.1
  Bottom 0.152: v37.47,21.41 39.14,23.09 40.36,23.09 48.44,31.17 v48.44,32.61
SERVO6  (via drill 0.25)
  Top 0.152: v30.38,25.98 35.56,20.8 35.56,20.42 A1.12
  Bottom 0.152: v30.38,25.98 30.38,26.14 28.47,28.04 28.47,29.41 29.01,29.95 29.01,32.46 43.56,47.02 43.56,48.77 45.08,50.29 RA.1
TRIG
  Top 0.152: A1.24 31.75,2.74 31.75,2.97 25.73,8.99 19.41,8.99 17.35,11.05 J3.2
TXD  (via drill 0.25)
  Top 0.152: v43.87,21.41 43.87,22.4 41.73,24.54 40.67,24.54 40.21,24.99 40.21,28.04 39.06,29.18 37.85,29.18 37.39,29.64 37.39,34.21 34.04,37.57 34.04,42.44 33.35,43.13 32.82,43.13 U2.25 | v43.87,18.82 43.87,15.24 45.77,13.34 45.77,2.74 A1.35
  Bottom 0.152: v43.87,18.82 v43.87,21.41
USBV+  (via drill 0.25)
  Top 0.152: 31.86,48.27 31.75,48.39 31.75,49.07 USB1.1 | 31.86,48.27 32.21,47.93 33.27,47.93 33.88,47.32 33.88,45.19 35.1,43.97 35.25,43.97 U4.6 | v22.99,45.34 24.13,46.48 24.13,46.63 R8.1 | v22.99,43.59 22.99,41.45 23.75,40.69 D1.2 | v31.6,48.01 31.86,48.27
  Bottom 0.152: v22.99,43.59 v22.99,45.34 23.44,45.8 29.39,45.8 v31.6,48.01
V+  (via drill 0.25)
  Top 1.016: J3.1 17.35,8.53 17.35,5.94 JP3.1 17.35,5.49 14.45,2.59 11.63,2.59 JP6.1 11.1,2.74 2.49,11.35 2.49,31.47 7.82,36.8 D2.1 8.13,37.26 8.89,37.26 12.7,41.07 J1.+ 13.23,41.22 16.59,41.22 17.35,41.99 17.8,42.22 | 34.11,28.12 34.11,27.28 35.56,25.83 C1.1 | 34.11,28.12 34.11,29.18 35.1,30.18 35.48,30.18 R6.2 | 17.8,42.22 17.8,48.84 C3.1 | 17.8,42.22 19.33,40.69 D1.1 19.18,40.16 17.8,38.79 17.8,32.92 | 17.8,32.92 19.41,31.32 U3.3 19.86,31.01 22.45,28.42 v29.24,28.42 | v31.52,28.12 34.11,28.12 | LL.2 47.68,35.51 47.68,38.48 RL.2 47.68,39.01 47.68,41.53 LF.2 47.68,42.06 47.68,44.58 RF.2 47.68,45.11 47.68,47.62 LA.2 47.6,48.16 47.6,50.67 RA.2 | J2.1 12.7,32.54 15.14,32.54 J2.6 15.67,32.69 17.35,32.69 17.8,32.92
  Bottom 1.016: v29.24,28.42 31.22,28.42 v31.52,28.12 31.98,28.35 42.44,28.35 47.61,33.52 47.61,33.67 47.22,33.98 47.14,34.06 47.14,34.75 47.6,35.2 47.6,35.43 LL.2
VSENSE
  Top 0.152: R6.1 35.56,28.42 35.56,27.28 37.31,25.53 37.31,24.92 38.23,24 R10.2 38.3,23.93 39.22,23.01 40.74,23.01 43.18,20.57 43.18,20.42 A1.6

### Text on the board
tNames: + | Battery | GND | V+ | 3.3V | 12 | GND | 21 | 32 | BTN1 | BTN2 | Noise | GND | GND | Echo | CLK | Trig | CS | V+ | DIN | GND | V+ | Buzzer | V+ | Buzzer
bNames: ESP32 / OTTO